# Altium project YFCX_4S5P_ZJB_V10_260724.PrjPcb
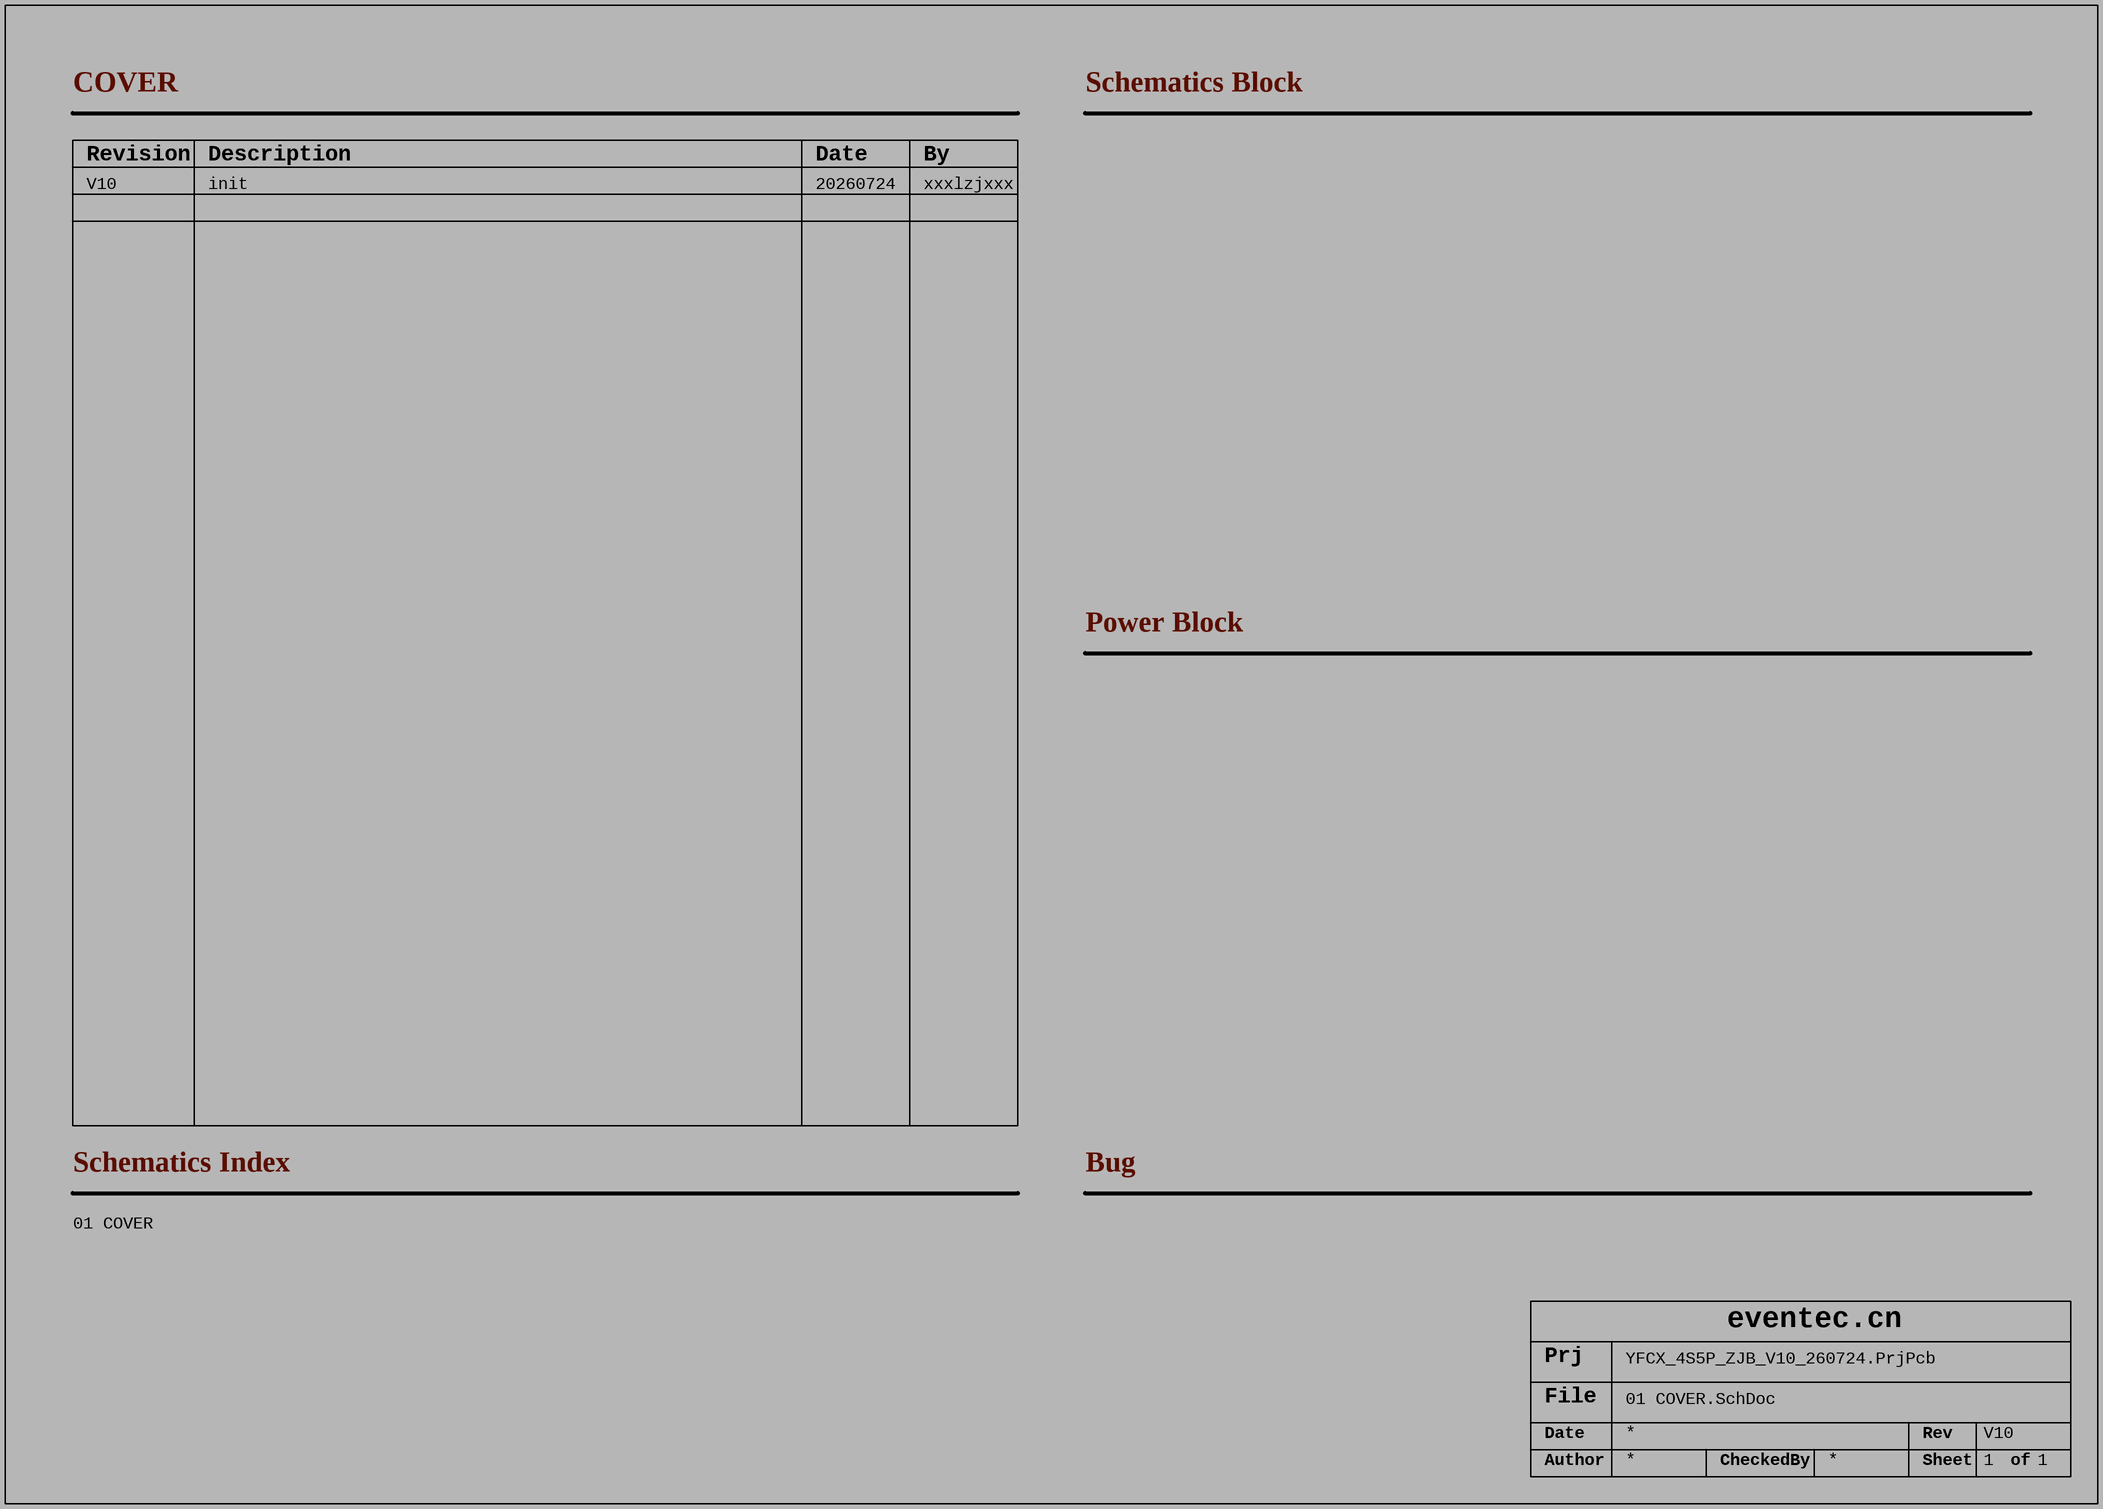
[diagram p0: 01 COVER.SchDoc]
2 sheets, 95 parts. Net scope: global (net labels, ports and power ports of the same name join across sheets).
Board file: YFCX_4S5P_ZJB_V10_260724.PcbDoc
Sheets:
  01 COVER.SchDoc
  02 IO.SchDoc

## Sheet 01 COVER.SchDoc
size A3; Revision: V10; SheetNumber: 1; SheetTotal: 1

### Notes on the sheet
- COVER
- Schematics Block
- Revision
- Description
- Date
- By
- V10
- init
- 20260724
- xxxlzjxxx
- Power Block
- Schematics Index
- Bug
- 01 COVER
- Prj
- eventec.cn
- File
- Rev
- Author
- CheckedBy
- Sheet
- of

## Sheet 02 IO.SchDoc
size A3; SheetNumber: 2; SheetTotal: 2
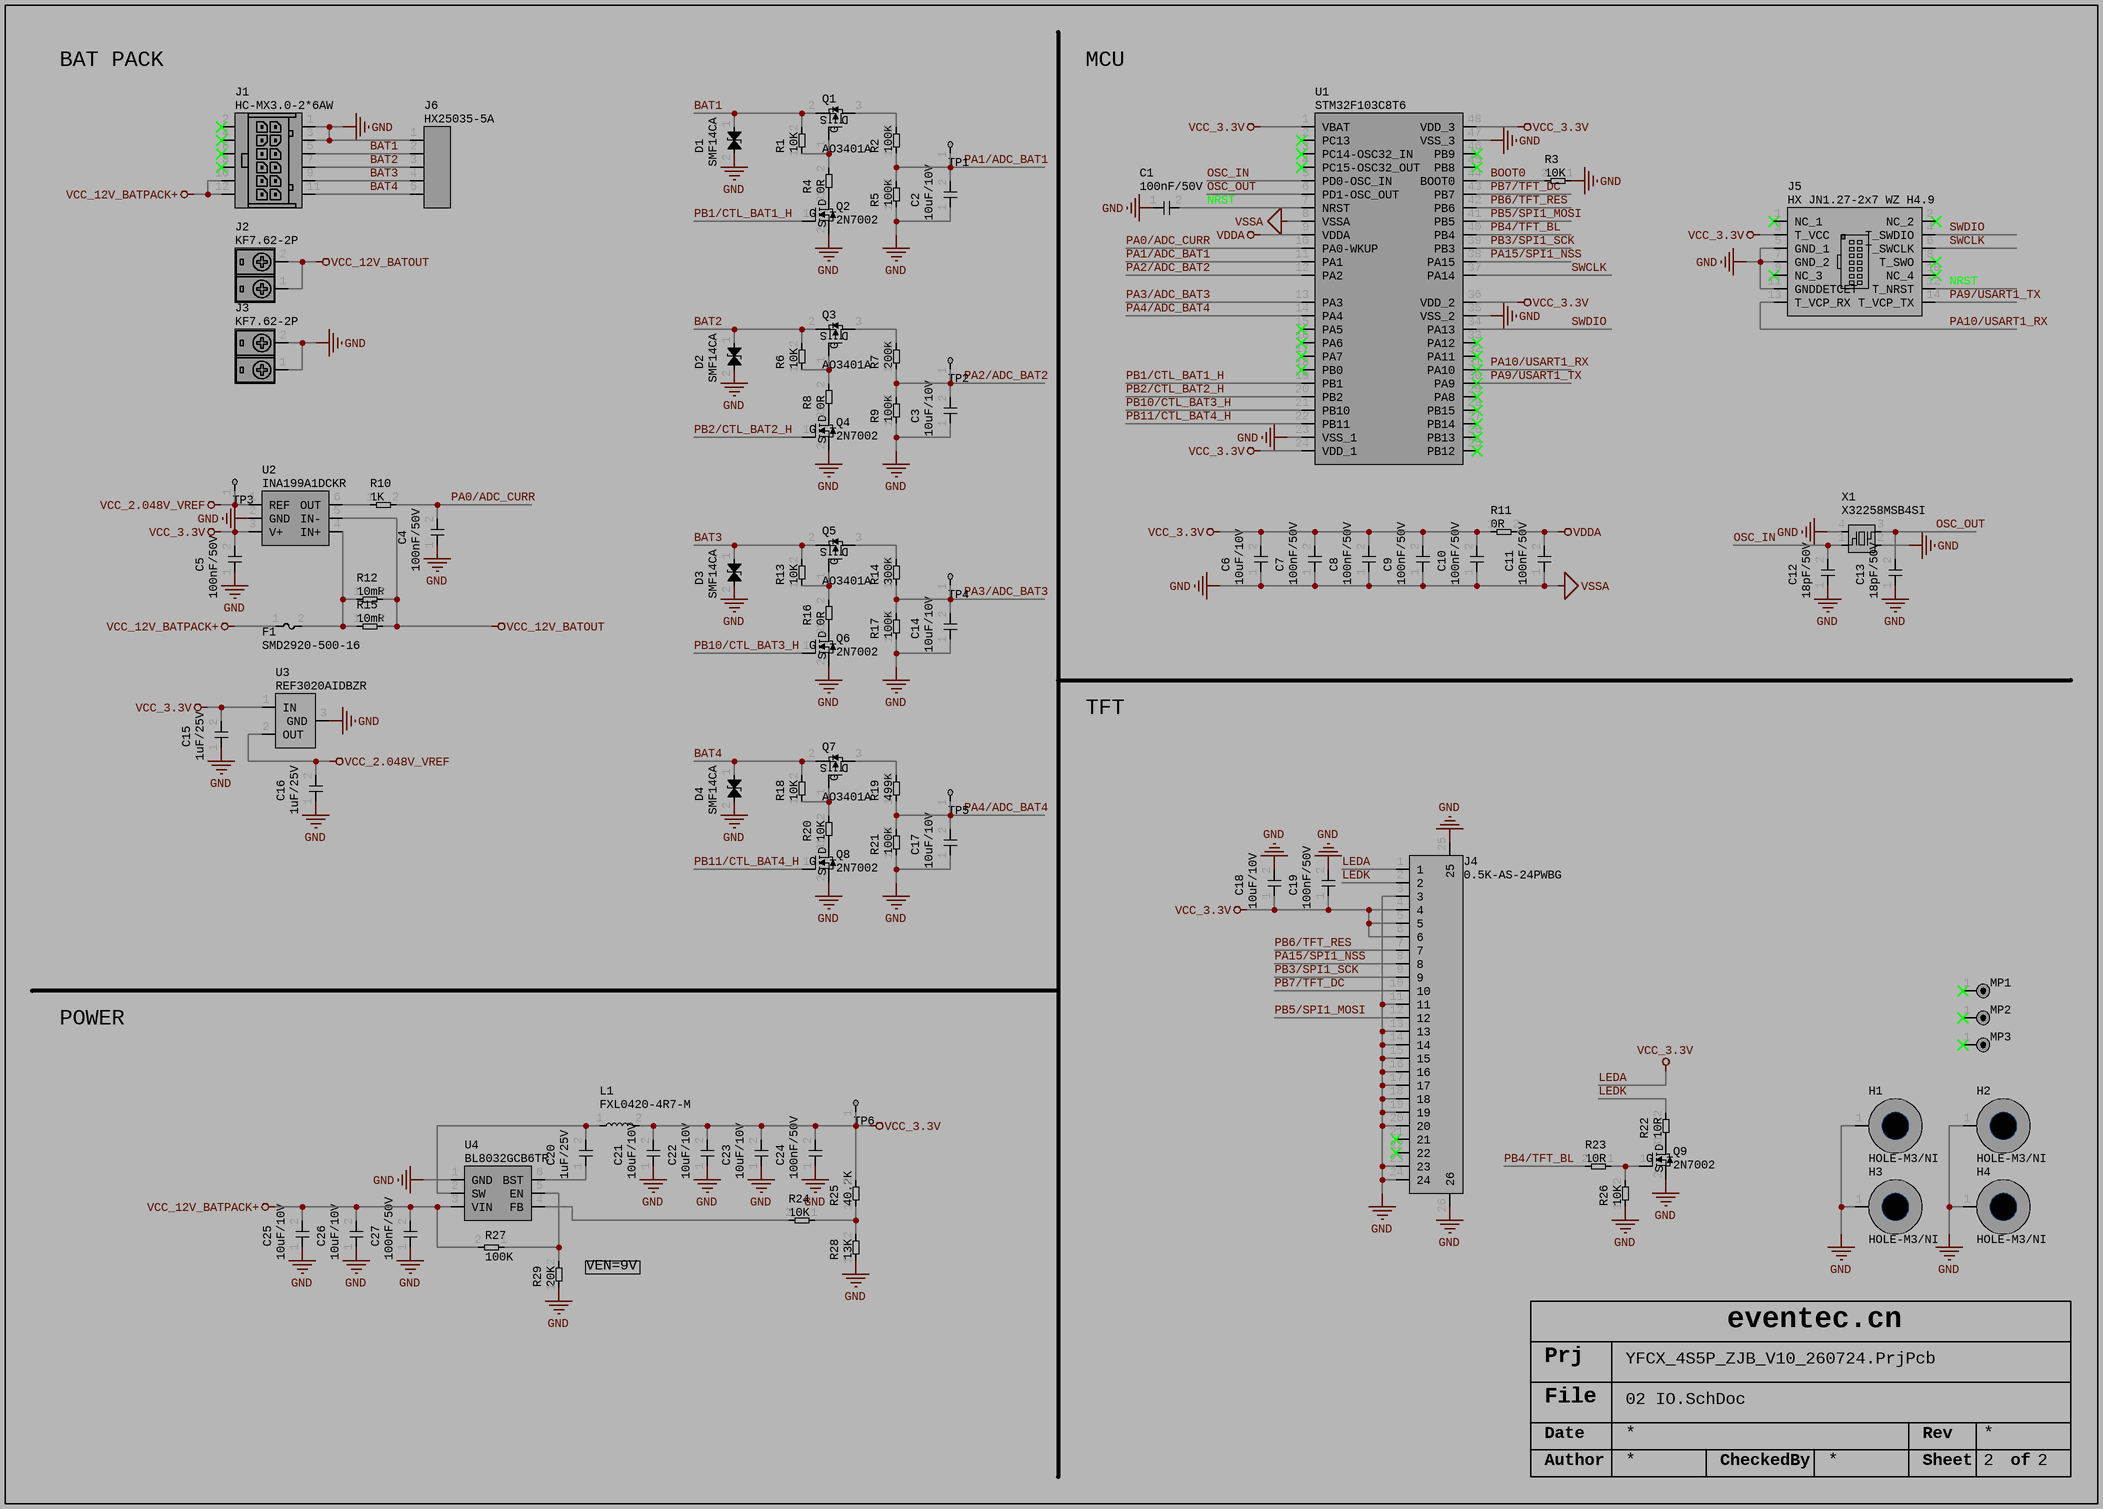
[diagram p1: 02 IO.SchDoc]

### Parts
C1  100nF/50V  [C0402]
C2  10uF/10V  [C0603]
C3  10uF/10V  [C0603]
C4  100nF/50V  [C0402]
C5  100nF/50V  [C0402]
C6  10uF/10V  [C0603]
C7  100nF/50V  [C0402]
C8  100nF/50V  [C0402]
C9  100nF/50V  [C0402]
C10  100nF/50V  [C0402]
C11  100nF/50V  [C0402]
C12  18pF/50V  [C0402]
C13  18pF/50V  [C0402]
C14  10uF/10V  [C0603]
C15  1uF/25V  [C0402]
C16  1uF/25V  [C0402]
C17  10uF/10V  [C0603]
C18  10uF/10V  [C0603]
C19  100nF/50V  [C0402]
C20  1uF/25V  [C0402]
C21  10uF/10V  [C0603]
C22  10uF/10V  [C0603]
C23  10uF/10V  [C0603]
C24  100nF/50V  [C0402]
C25  10uF/10V  [C0603]
C26  10uF/10V  [C0603]
C27  100nF/50V  [C0402]
D1  SMF14CA  [SOD123]
D2  SMF14CA  [SOD123]
D3  SMF14CA  [SOD123]
D4  SMF14CA  [SOD123]
F1  SMD2920-500-16  [FUSE2920]
H1  HOLE-M3/NI  [HOLE6R90X3R10]
H2  HOLE-M3/NI  [HOLE6R90X3R10]
H3  HOLE-M3/NI  [HOLE6R90X3R10]
H4  HOLE-M3/NI  [HOLE6R90X3R10]
J1  HC-MX3.0-2*6AW  [HC-MX3R0-2X6AW]
J2  KF7.62-2P  [KF7R62-2P]
J3  KF7.62-2P  [KF7R62-2P]
J4  0.5K-AS-24PWBG  [0R5K-AS-24PWBG]
J5  HX JN1.27-2x7 WZ H4.9  [STDC14-W]
J6  HX25035-5A  [HX25035-5A]
L1  FXL0420-4R7-M  [L0420]
MP1  MARK-R3/NI  [MARK-R3]  (value not drawn)
MP2  MARK-R3/NI  [MARK-R3]  (value not drawn)
MP3  MARK-R3/NI  [MARK-R3]  (value not drawn)
Q1  AO3401A  [SOT23-3]
Q2  2N7002  [SOT23-3]
Q3  AO3401A  [SOT23-3]
Q4  2N7002  [SOT23-3]
Q5  AO3401A  [SOT23-3]
Q6  2N7002  [SOT23-3]
Q7  AO3401A  [SOT23-3]
Q8  2N7002  [SOT23-3]
Q9  2N7002  [SOT23-3]
R1  10K  [R0402]
R2  100K  [R0402]
R3  10K  [R0402]
R4  0R  [R0402]
R5  100K  [R0402]
R6  10K  [R0402]
R7  200K  [R0402]
R8  0R  [R0402]
R9  100K  [R0402]
R10  1K  [R0402]
R11  0R  [R0402]
R12  10mR  [R2512]
R13  10K  [R0402]
R14  300K  [R0402]
R15  10mR  [R2512]
R16  0R  [R0402]
R17  100K  [R0402]
R18  10K  [R0402]
R19  499K  [R0402]
R20  10K  [R0402]
R21  100K  [R0402]
R22  10R  [R0805]
R23  10R  [R0805]
R24  10K  [R0402]
R25  40.2K  [R0402]
R26  10K  [R0402]
R27  100K  [R0402]
R28  13K  [R0402]
R29  20K  [R0402]
TP1  TP-R2/NI  [TP-R2]  (value not drawn)
TP2  TP-R2/NI  [TP-R2]  (value not drawn)
TP3  TP-R2/NI  [TP-R2]  (value not drawn)
TP4  TP-R2/NI  [TP-R2]  (value not drawn)
TP5  TP-R2/NI  [TP-R2]  (value not drawn)
TP6  TP-R2/NI  [TP-R2]  (value not drawn)
U1  STM32F103C8T6  [LQFP48-7X7X0R5]
U2  INA199A1DCKR  [SOT363]
U3  REF3020AIDBZR  [SOT23-3]
U4  BL8032GCB6TR  [SOT23-6]
X1  X32258MSB4SI  [X-4P-3R2X2R5-SMD]

### Nets
GND: C1.1 C2.1 C3.1 C4.1 C5.1 C6.1 C7.1 C8.1 C9.1 C10.1 C11.1 C12.1 C13.1 C14.1 C15.1 C16.1 C17.1 C18.2 C19.2 C21.1 C22.1 C23.1 C24.1 C25.1 C26.1 C27.1 D1.2 D2.2 D3.2 D4.2 H1.1 H2.1 H3.1 H4.1 J1.1 J1.3 J3.1 J3.2 J4.3 J4.11 J4.13 J4.14 J4.15 J4.16 J4.17 J4.18 J4.19 J4.20 J4.23 J4.24 J4.25 J4.26 J5.5(GND_1) J5.7(GND_2) J5.11(GNDDETCET) J6.1 Q2.2(S) Q4.2(S) Q6.2(S) Q8.2(S) Q9.2(S) R3.1 R5.1 R9.1 R17.1 R21.1 R26.1 R28.1 R29.1 U1.8(VSSA) U1.23(VSS_1) U1.35(VSS_2) U1.47(VSS_3) U2.2(GND) U3.3(GND) U4.1(GND) X1.2 X1.4  [also labelled VSSA]
LEDA: C5.2 C6.2 C7.2 C8.2 C9.2 C10.2 C15.2 C18.1 C19.1 C21.2 C22.2 C23.2 C24.2 J4.1 J4.4 J4.5 J4.6 J5.3(T_VCC) L1.2 R11.1 R25.2 TP6.1 U1.1(VBAT) U1.24(VDD_1) U1.36(VDD_2) U1.48(VDD_3) U2.3(V+) U3.1(IN)  [also labelled VCC_3.3V]
VCC_2.048V_VREF: C16.2 TP3.1 U2.1(REF) U3.2(OUT)
VCC_12V_BATOUT: J2.1 J2.2 R12.2 R15.2 U2.5(IN-)
VCC_12V_BATPACK+: C25.2 C26.2 C27.2 F1.1 J1.10 J1.12 R27.2 U4.3(VIN)
VDDA: C11.2 R11.2 U1.9(VDDA)
BAT1: D1.1 J1.5 J6.2 Q1.2(S) R1.2
BAT2: D2.1 J1.7 J6.3 Q3.2(S) R6.2
BAT3: D3.1 J1.9 J6.4 Q5.2(S) R13.2
BAT4: D4.1 J1.11 J6.5 Q7.2(S) R18.2
BOOT0: R3.2 U1.44(BOOT0)
LEDK: J4.2 R22.2
NRST: C1.2 J5.12(T_NRST) U1.7(NRST)
OSC_IN: C12.2 U1.5(PD0-OSC_IN) X1.1
OSC_OUT: C13.2 U1.6(PD1-OSC_OUT) X1.3
PA0/ADC_CURR: C4.2 R10.2 U1.10(PA0-WKUP)
PA1/ADC_BAT1: C2.2 R2.1 R5.2 TP1.1 U1.11(PA1)
PA2/ADC_BAT2: C3.2 R7.1 R9.2 TP2.1 U1.12(PA2)
PA3/ADC_BAT3: C14.2 R14.1 R17.2 TP4.1 U1.13(PA3)
PA4/ADC_BAT4: C17.2 R19.1 R21.2 TP5.1 U1.14(PA4)
PA9/USART1_TX: J5.14(T_VCP_TX) U1.30(PA9)
PA10/USART1_RX: J5.13(T_VCP_RX) U1.31(PA10)
PA15/SPI1_NSS: J4.8 U1.38(PA15)
PB1/CTL_BAT1_H: Q2.1(G) U1.19(PB1)
PB2/CTL_BAT2_H: Q4.1(G) U1.20(PB2)
PB3/SPI1_SCK: J4.9 U1.39(PB3)
PB4/TFT_BL: R23.2 U1.40(PB4)
PB5/SPI1_MOSI: J4.12 U1.41(PB5)
PB6/TFT_RES: J4.7 U1.42(PB6)
PB7/TFT_DC: J4.10 U1.43(PB7)
PB10/CTL_BAT3_H: Q6.1(G) U1.21(PB10)
PB11/CTL_BAT4_H: Q8.1(G) U1.22(PB11)
SWCLK: J5.6(T_SWCLK) U1.37(PA14)
SWDIO: J5.4(T_SWDIO) U1.34(PA13)
NetC20_1: C20.1 U4.6(BST)
NetC20_2: C20.2 L1.1 U4.2(SW)
NetF1_2: F1.2 R12.1 R15.1 U2.4(IN+)
NetQ1_1: Q1.1(G) R1.1 R4.2
NetQ1_3: Q1.3(D) R2.2
NetQ2_3: Q2.3(D) R4.1
NetQ3_1: Q3.1(G) R6.1 R8.2
NetQ3_3: Q3.3(D) R7.2
NetQ4_3: Q4.3(D) R8.1
NetQ5_1: Q5.1(G) R13.1 R16.2
NetQ5_3: Q5.3(D) R14.2
NetQ6_3: Q6.3(D) R16.1
NetQ7_1: Q7.1(G) R18.1 R20.2
NetQ7_3: Q7.3(D) R19.2
NetQ8_3: Q8.3(D) R20.1
NetQ9_1: Q9.1(G) R23.1 R26.2
NetQ9_3: Q9.3(D) R22.1
NetR10_1: R10.1 U2.6(OUT)
NetR24_1: R24.1 R25.1 R28.2
NetR24_2: R24.2 U4.4(FB)
NetR27_1: R27.1 R29.2 U4.5(EN)

Not connected (* = marked no-connect by the designer): J1 2* 4* 6* 8*; J4 21* 22*; J5 1(NC_1)* 2(NC_2)* 8(T_SWO)* 9(NC_3)* 10(NC_4)*; MP1 1*; MP2 1*; MP3 1*; U1 2(PC13)* 3(PC14-OSC32_IN)* 4(PC15-OSC32_OUT)* 15(PA5)* 16(PA6)* 17(PA7)* 18(PB0)* 25(PB12)* 26(PB13)* 27(PB14)* 28(PB15)* 29(PA8)* 32(PA11)* 33(PA12)* 45(PB8)* 46(PB9)*

### Notes on the sheet
- BAT PACK
- MCU
- TFT
- POWER
- (near R29) VEN=9V
- Prj
- eventec.cn
- File
- Date
- Rev
- Author
- CheckedBy
- Sheet
- of

### Library data of the parts
C2 C3 C6 C12-C18 C20-C23 C25 C26 = 100nF/50V: ERPcode: *
  C2 C3 C6 C14 C17 C18 C21-C23 C25 C26: Value: 10uF/10V; JLCcode: C19702
  C12 C13: Value: 18pF/50V; JLCcode: C1549
  C15 C16 C20: Value: 1uF/25V; JLCcode: C52923
D1-D4 = TVS-BDIR: Value: SMF14CA; ERPcode: *; JLCcode: C41411783
F1 = FUSE: Value: SMD2920-500-16; ERPcode: *; JLCcode: C47753902
H1-H4 = HOLE-M3: ERPcode: *; JLCcode: *; Value: HOLE-M3/NI
J5 = STDC14: Value: HX JN1.27-2x7 WZ H4.9; ERPcode: *; JLCcode: C46061775
L1 = INDUC: Value: FXL0420-4R7-M; ERPcode: *; JLCcode: C167208
MP1-MP3 = MARK-R3: ERPcode: *; JLCcode: *; Value: MARK-R3/NI
Q1 Q3 Q5 Q7 = MOS-P: Value: AO3401A; ERPcode: *; JLCcode: C15127
Q2 Q4 Q6 Q8 Q9 = MOS-N: Value: 2N7002; ERPcode: *; JLCcode: C8545
R1-R9 R11-R25 R27-R29 = 1K: ERPcode: *
  R1 R3 R6 R13 R18 R20 R24: Value: 10K; JLCcode: C25744
  R2 R5 R9 R17 R21 R27: Value: 100K; JLCcode: C25741
  R4 R8 R11 R16: Value: 0R; JLCcode: C17168
  R7: Value: 200K; JLCcode: C25764
  R12 R15: Value: 10mR; JLCcode: C2903468
  R14: Value: 300K; JLCcode: C25774
  R19: Value: 499K; JLCcode: C25793
  R22 R23: Value: 10R; JLCcode: C17415
  R25: Value: 40.2K; JLCcode: C25893
  R28: Value: 13K; JLCcode: C25754
  R29: Value: 20K; JLCcode: C25765
R26 = 1K: Value: 1K; ERPcode: *; JLCcode: C11702
TP1-TP6 = TP-R2: ERPcode: *; JLCcode: *; Value: TP-R2/NI
X1 = XTAL: Value: X32258MSB4SI; ERPcode: *; JLCcode: C2682774
C1 C4 C5 C7-C11 C19 C24 C27 = 100nF/50V: Value: 100nF/50V; ERPcode: *; JLCcode: C307331
J1 = HC-MX3.0-2*6AW: Value: HC-MX3.0-2*6AW; ERPcode: *; JLCcode: C3294387
J2 J3 = KF7.62-2P: Value: KF7.62-2P; ERPcode: *; JLCcode: C707824
J4 = 0.5K-AS-24PWBG: Value: 0.5K-AS-24PWBG; ERPcode: *; JLCcode: C2911807
J6 = HX25035-5A: Value: HX25035-5A; ERPcode: *; JLCcode: C442381
R10 = 1K: Value: 1K; ERPcode: *; JLCcode: C11702
U1 = STM32F103C8T6: Value: STM32F103C8T6; ERPcode: *; JLCcode: C8734
U2 = INA199A1DCKR: Value: INA199A1DCKR; ERPcode: *; JLCcode: C59135
U3 = REF3020AIDBZR: Value: REF3020AIDBZR; ERPcode: *; JLCcode: C26804
U4 = BL8032GCB6TR: Value: BL8032GCB6TR; ERPcode: *; JLCcode: C7436534